# EAGLE schematic PowerRhythm32 (EAGLE 6.1)
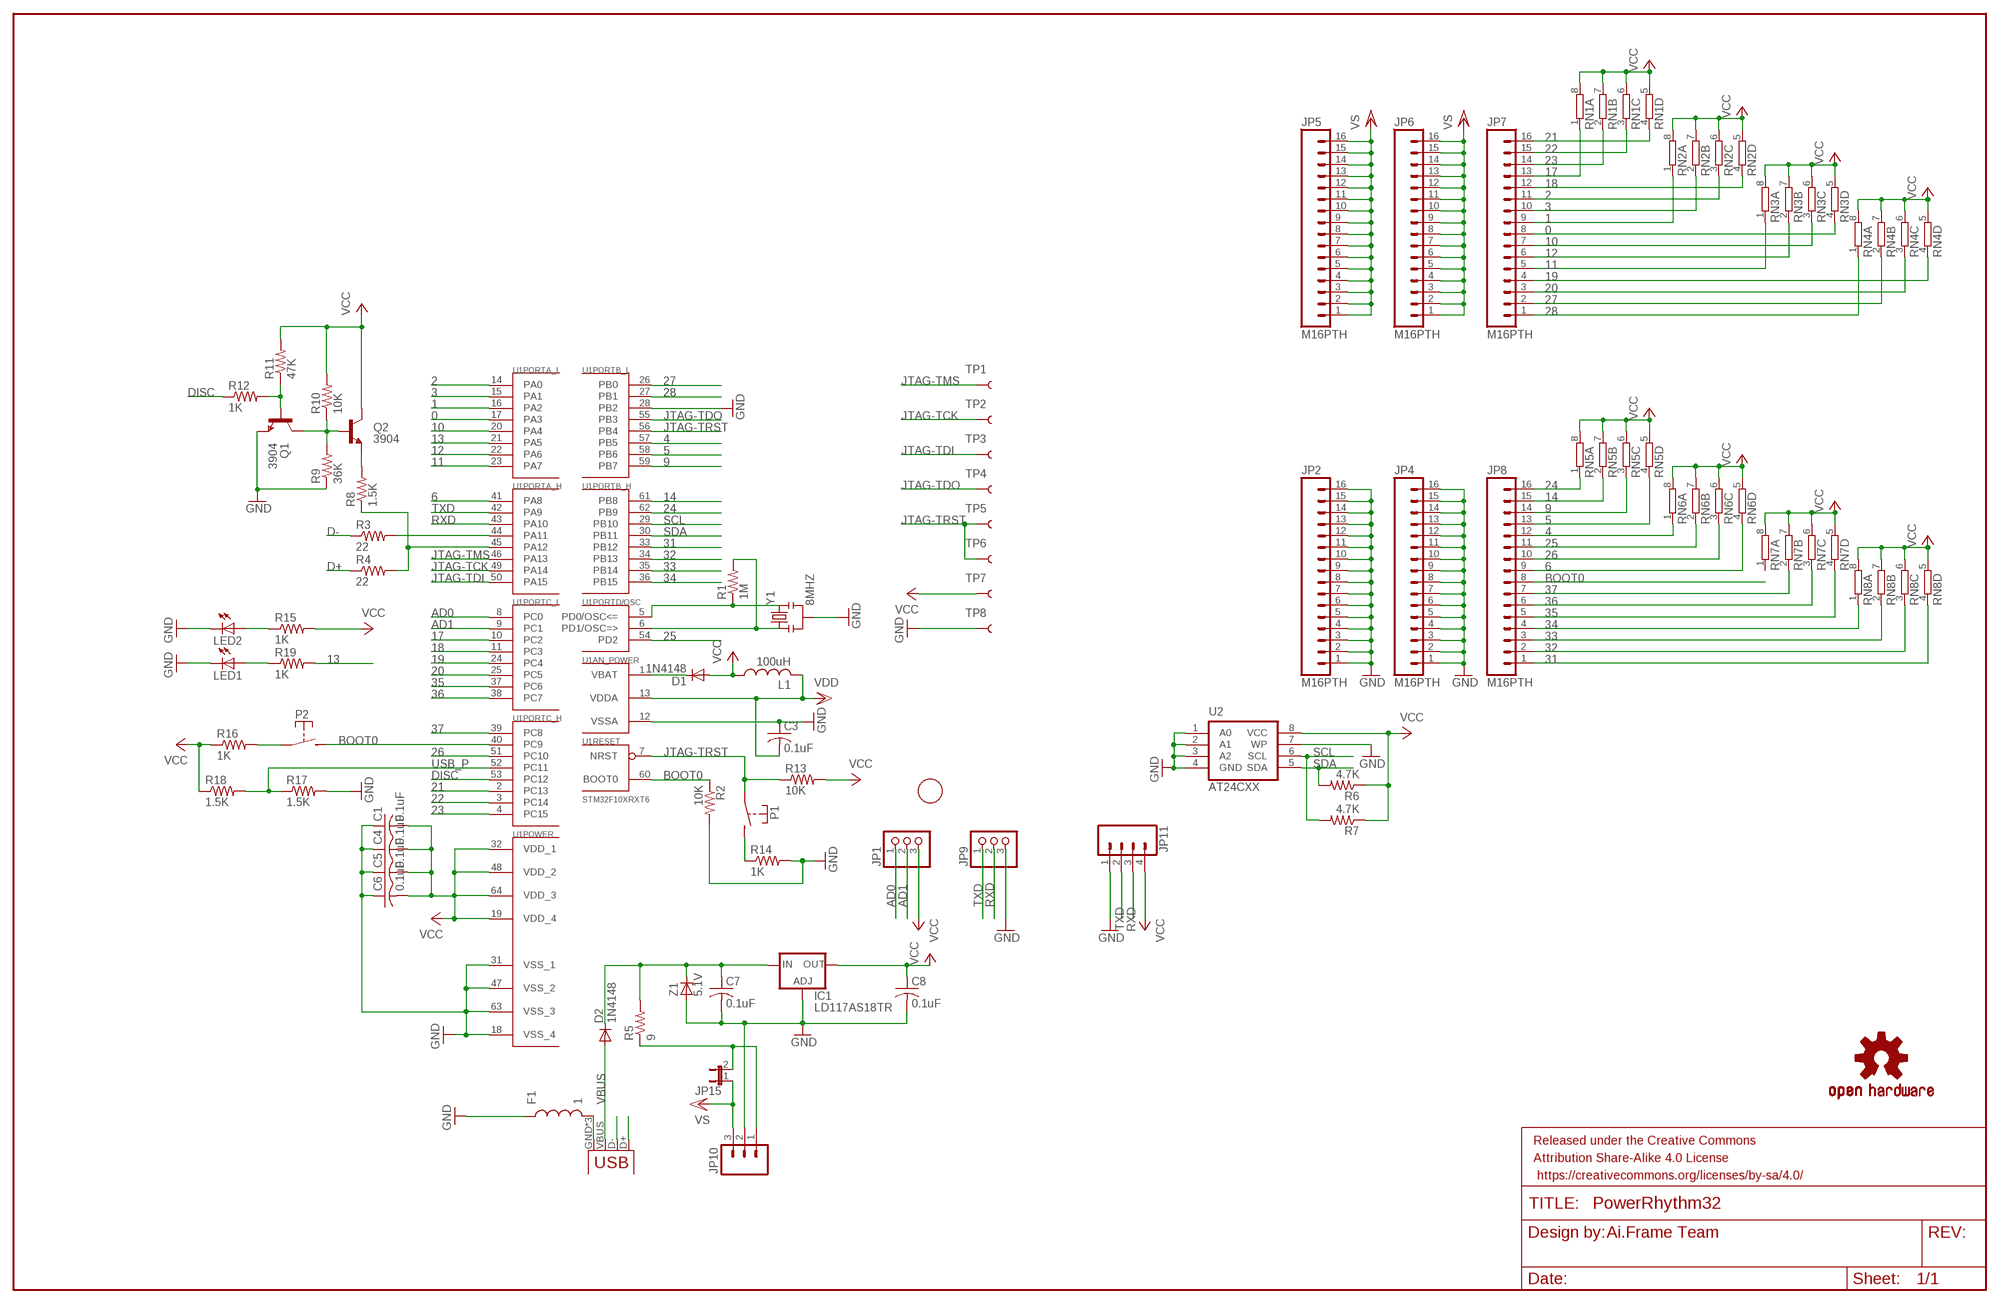
[diagram p0: schematic, sheet 1]

## Parts
C1  0.1uF  C-USC0603K  [C0603K]
C3  0.1uF  C-USC0603K  [C0603K]
C4  0.1uF  C-USC0603K  [C0603K]
C5  0.1uF  C-USC0603K  [C0603K]
C6  0.1uF  C-USC0603K  [C0603K]
C7  0.1uF  C-USC0603K  [C0603K]
C8  0.1uF  C-USC0603K  [C0603K]
D1  1N4148  DIODE-SOD123  [SOD123]
D2  1N4148  DIODE-SOD123  [SOD123]
F1  1  INDUCTOR30OHM,1.8A  [0603]
FRAME1  FRAME-LEDGER  [CREATIVE_COMMONS]
IC1  LD117AS18TR  [SOT223]
JP1  PINHD-1X3  [1X03]
JP2  M16PTH  [1X16]
JP3  USB-MICROB  [USB-MICROB]
JP4  M16PTH  [1X16]
JP5  M16PTH  [1X16]
JP6  M16PTH  [1X16]
JP7  M16PTH  [1X16]
JP8  M16PTH  [1X16]
JP9  PINHD-1X3  [1X03]
JP10  M03SCREW_LOCK  [SCREWTERMINAL-3.5MM-3_LOCK.007S]
JP11  M04PTH  [1X04]
JP15  JUMPER-2PTH  [1X02]
L1  100uH  L-USL2012C  [L2012C]
LED1  LEDCHIP-LED0603  [CHIP-LED0603]
LED2  LEDCHIP-LED0603  [CHIP-LED0603]
LOGO1  OSHW-LOGOS  [OSHW-LOGO-S]
P1  TMAV433BAA  [TMAV433BAA]
P2  TMAV433BAA  [TMAV433BAA]
Q1  3904  TRANSISTOR_NPNMMBT2222A  [SOT23-3]
Q2  3904  TRANSISTOR_NPNMMBT2222A  [SOT23-3]
R1  1M  R-US_R0603  [R0603]
R2  10K  R-US_R0603  [R0603]
R3  22  R-US_R0603  [R0603]
R4  22  R-US_R0603  [R0603]
R5  9  R-US_R1206  [R1206]
R6  4.7K  R-US_R0603  [R0603]
R7  4.7K  R-US_R0603  [R0603]
R8  1.5K  R-US_R0603  [R0603]
R9  36K  R-US_R0603  [R0603]
R10  10K  R-US_R0603  [R0603]
R11  47K  R-US_R0603  [R0603]
R12  1K  R-US_R0603  [R0603]
R13  10K  R-US_R0603  [R0603]
R14  1K  R-US_R0603  [R0603]
R15  1K  R-US_R0603  [R0603]
R16  1K  R-US_R0603  [R0603]
R17  1.5K  R-US_R0603  [R0603]
R18  1.5K  R-US_R0603  [R0603]
R19  1K  R-US_R0603  [R0603]
RN1  4R-N0603-ARC  [0603-ARC]
RN2  4R-N0603-ARC  [0603-ARC]
RN3  4R-N0603-ARC  [0603-ARC]
RN4  4R-N0603-ARC  [0603-ARC]
RN5  4R-N0603-ARC  [0603-ARC]
RN6  4R-N0603-ARC  [0603-ARC]
RN7  4R-N0603-ARC  [0603-ARC]
RN8  4R-N0603-ARC  [0603-ARC]
TP1  TEST-POINT3X5  [PAD.03X.05]
TP2  TEST-POINT3X5  [PAD.03X.05]
TP3  TEST-POINT3X5  [PAD.03X.05]
TP4  TEST-POINT3X5  [PAD.03X.05]
TP5  TEST-POINT3X5  [PAD.03X.05]
TP6  TEST-POINT3X5  [PAD.03X.05]
TP7  TEST-POINT3X5  [PAD.03X.05]
TP8  TEST-POINT3X5  [PAD.03X.05]
U1  STM32F10XRXT6  [TQFP64]
U2  AT24CXX  [SO08-8S1]
U$1  FIDUCIAL  [FIDUCIAL_1MM]
Y1  8MHZ  RESONATOR8MHZ  [RESONATOR-SMD]
Z1  5.1V  ZENER-DIODESOD80C  [SOD80C]

## Nets
0: JP7.8 RN3.4 U1.17(PORTA_L:PA3)
1: JP7.9 RN2.1 U1.16(PORTA_L:PA2)
2: JP7.11 RN2.3 U1.14(PORTA_L:PA0)
3: JP7.10 RN2.2 U1.15(PORTA_L:PA1)
4: JP8.12 RN6.1 U1.57(PORTB_L:PB5)
5: JP8.13 RN5.4 U1.58(PORTB_L:PB6)
6: JP8.9 RN6.4 U1.41(PORTA_H:PA8)
9: JP8.14 RN5.3 U1.59(PORTB_L:PB7)
10: JP7.7 RN3.3 U1.20(PORTA_L:PA4)
11: JP7.5 RN3.1 U1.23(PORTA_L:PA7)
12: JP7.6 RN3.2 U1.22(PORTA_L:PA6)
13: R19.2 U1.21(PORTA_L:PA5)
14: JP8.15 RN5.2 U1.61(PORTB_H:PB8)
17: JP7.13 RN1.1 U1.10(PORTC_L:PC2)
18: JP7.12 RN2.4 U1.11(PORTC_L:PC3)
19: JP7.4 RN4.4 U1.24(PORTC_L:PC4)
20: JP7.3 RN4.3 U1.25(PORTC_L:PC5)
21: JP7.16 RN1.4 U1.2(PORTC_H:PC13)
22: JP7.15 RN1.3 U1.3(PORTC_H:PC14)
23: JP7.14 RN1.2 U1.4(PORTC_H:PC15)
24: JP8.16 RN5.1 U1.62(PORTB_H:PB9)
25: JP8.11 RN6.2 U1.54(PORTD/OSC:PD2)
26: JP8.10 RN6.3 U1.51(PORTC_H:PC10)
27: JP7.2 RN4.2 U1.26(PORTB_L:PB0)
28: JP7.1 RN4.1 U1.27(PORTB_L:PB1)
31: JP8.1 RN8.4 U1.33(PORTB_H:PB12)
32: JP8.2 RN8.3 U1.34(PORTB_H:PB13)
33: JP8.3 RN8.2 U1.35(PORTB_H:PB14)
34: JP8.4 RN8.1 U1.36(PORTB_H:PB15)
35: JP8.5 RN7.4 U1.37(PORTC_L:PC6)
36: JP8.6 RN7.3 U1.38(PORTC_L:PC7)
37: JP8.7 RN7.2 U1.39(PORTC_H:PC8)
AD0: JP1.1 U1.8(PORTC_L:PC0)
AD1: JP1.2 U1.9(PORTC_L:PC1)
BOOT0: JP8.8 P2.P$2(S) R2.1 U1.40(PORTC_H:PC9) U1.60(RESET:BOOT0)
D+: JP3.D+ R4.1
D-: JP3.D- R3.1
DISC: R12.1 U1.53(PORTC_H:PC12)
GND: C1.1 C3.1 C4.1 C5.1 C6.1 C7.2 C8.2 F1.1 IC1.1(ADJ) JP2.1 JP2.2 JP2.3 JP2.4 JP2.5 JP2.6 JP2.7 JP2.8 JP2.9 JP2.10 JP2.11 JP2.12 JP2.13 JP2.14 JP2.15 JP2.16 JP4.1 JP4.2 JP4.3 JP4.4 JP4.5 JP4.6 JP4.7 JP4.8 JP4.9 JP4.10 JP4.11 JP4.12 JP4.13 JP4.14 JP4.15 JP4.16 JP9.3 JP10.2 JP11.1 LED1.C LED2.C Q1.2(E) R2.2 R9.1 R14.2 R17.2 TP8.P$1 U1.12(AN_POWER:VSSA) U1.18(POWER:VSS_4) U1.28(PORTB_L:PB2) U1.31(POWER:VSS_1) U1.47(POWER:VSS_2) U1.63(POWER:VSS_3) U2.1(A0) U2.2(A1) U2.3(A2) U2.4(GND) U2.7(WP) Y1.2 Z1.A
JTAG-TCK: TP2.P$1 U1.49(PORTA_H:PA14)
JTAG-TDI: TP3.P$1 U1.50(PORTA_H:PA15)
JTAG-TDO: TP4.P$1 U1.55(PORTB_L:PB3)
JTAG-TMS: TP1.P$1 U1.46(PORTA_H:PA13)
JTAG-TRST: P1.P$1(P) R13.1 TP5.P$1 TP6.P$1 U1.7(RESET:NRST) U1.56(PORTB_L:PB4)
N$1: R1.2 U1.6(PORTD/OSC:PD1/OSC=>) Y1.1
N$2: D1.C U1.1(AN_POWER:VBAT)
N$3: LED2.A R15.1
N$4: R4.2 R8.1 U1.45(PORTA_H:PA12)
N$5: JP10.1 JP15.2 R5.1
N$6: R1.1 U1.5(PORTD/OSC:PD0/OSC<=) Y1.3
N$8: R3.2 U1.44(PORTA_H:PA11)
N$9: C7.1 D2.C IC1.3(IN) R5.2 Z1.C
N$11: LED1.A R19.1
N$12: F1.2 JP3.GND JP3.MT1(GND) JP3.MT2(GND)
N$14: Q1.3(C) Q2.1(B) R9.2 R10.1
N$15: P1.P$2(S) R14.1
N$16: Q2.2(E) R8.2
N$17: Q1.1(B) R11.1 R12.2
N$19: P2.P$1(P) R16.2
RXD: JP9.2 JP11.3 U1.43(PORTA_H:PA10)
SCL: R7.2 U1.29(PORTB_H:PB10) U2.6(SCL)
SDA: R6.2 U1.30(PORTB_H:PB11) U2.5(SDA)
TXD: JP9.1 JP11.2 U1.42(PORTA_H:PA9)
USB_P: R17.1 R18.2 U1.52(PORTC_H:PC11)
VBUS: D2.A JP3.VBUS
VCC: C1.2 C4.2 C5.2 C6.2 C8.1 D1.A IC1.4(OUT) JP1.3 JP11.4 L1.1 Q2.3(C) R6.1 R7.1 R10.2 R11.2 R13.2 R15.2 R16.1 R18.1 RN1.5 RN1.6 RN1.7 RN1.8 RN2.5 RN2.6 RN2.7 RN2.8 RN3.5 RN3.6 RN3.7 RN3.8 RN4.5 RN4.6 RN4.7 RN4.8 RN5.5 RN5.6 RN5.7 RN5.8 RN6.5 RN6.6 RN6.7 RN6.8 RN7.5 RN7.6 RN7.7 RN7.8 RN8.5 RN8.6 RN8.7 RN8.8 TP7.P$1 U1.19(POWER:VDD_4) U1.32(POWER:VDD_1) U1.48(POWER:VDD_2) U1.64(POWER:VDD_3) U2.8(VCC)
VCC/2: JP5.1 JP5.2 JP5.3 JP5.4 JP5.5 JP5.6 JP5.7 JP5.8 JP5.9 JP5.10 JP5.11 JP5.12 JP5.13 JP5.14 JP5.15 JP5.16 JP6.1 JP6.2 JP6.3 JP6.4 JP6.5 JP6.6 JP6.7 JP6.8 JP6.9 JP6.10 JP6.11 JP6.12 JP6.13 JP6.14 JP6.15 JP6.16 JP10.3 JP15.1 ; supply symbol labelled VS
VDD: C3.2 L1.2 U1.13(AN_POWER:VDDA)
Unconnected: RN7.1

## Notes on the sheet
- Ai.Frame Team

## Library data of the parts
C1 C3-C8 = resistor:C-US: CAPACITOR, American symbol
D1 D2 = diode:DIODE-: DIODE
F1 = SparkFun-Passives:INDUCTOR: Inductors Basic Inductor/Choke - 0603 and 1206. Footprints are not proven and vary greatly between part numbers. SRN6045- 33uH, 20% 1.4A SDR0403-560KL - 56uH, 10%, 500mA RMS/740mA peak; PROD_ID: RES-07859
FRAME1 = SparkFun-Aesthetics:FRAME-LEDGER: Schematic Frame Standard 11x14 US Ledger frame
IC1 = v-reg:LD117A?*: Low drop fixed and adjustable positive voltage regulators 1 A Source: http://www.st.com/stonline/products/literature/ds/7194/ld1117axx.pdf
JP1 JP9 = adafruit:PINHD-1X3: PIN HEADER
JP2 JP4-JP8 = SparkFun-Connectors:M16: 1x16 .1" header
JP3 = SparkFun-Connectors:USB: USB Connectors USB-B-PTH is fully proven SKU : PRT-00139/CONN-08278 USB-miniB is fully proven SKU : PRT-00587 USB-A-PCB is untested. USB-A-H is throughly reviewed, but untested. Spark Fun Electronics SKU : PRT-00437 USB-B-SMT is throughly reviewed, but untested. Needs silkscreen touching up. USB-A-S has not been used/tested USB-MB-H has not been used/tested USB-MICROB has been used. CONN-09505; PROD_ID: CONN-09505
JP10 = SparkFun-Connectors:M03: Header 3 Standard 3-pin 0.1" header. Use with straight break away headers (SKU : PRT-00116), right angle break away headers (PRT-00553), swiss pins (PRT-00743), machine pins (PRT-00117), and female headers (PRT-00115). Molex polarized connector foot print use with SKU : PRT-08232 with associated crimp pins and housings.
JP11 = SparkFun-Connectors:M04: Header 4 Standard 4-pin 0.1" header. Use with straight break away headers (SKU : PRT-00116), right angle break away headers (PRT-00553), swiss pins (PRT-00743), machine pins (PRT-00117), and female headers (PRT-00115). Molex polarized connector foot print use with SKU : PRT-08231 with associated crimp pins and housings. 1MM SMD Version SKU: PRT-10208
JP15 = SparkFun-Passives:JUMPER-2: Jumper Basic 0.1" spaced jumper. Use with breakaway headers.
L1 = resistor:L-US: INDUCTOR, American symbol
LED1 LED2 = adafruit:LED: LED OSRAM: - CHIPLED LG R971, LG N971, LY N971, LG Q971, LY Q971, LO R971, LY R971 LH N974, LH R974 LS Q976, LO Q976, LY Q976 LO Q996 - Hyper CHIPLED LW Q18S LB Q993, LB Q99A, LB R99A - SideLED LS A670, LO A670, LY A670, LG A670, LP A670 LB A673, LV A673, LT A673, LW A673 LH A674 LY A675 LS A676, LA A676, LO A676, LY A676, LW A676 LS A679, LY A679, LG A679 - Hyper Micro SIDELED® LS Y876, LA Y876, LO Y876, LY Y876 LT Y87S - SmartLED LW L88C, LW L88S LB L89C, LB L89S, LG L890 LS L89K, LO L89K, LY L89K LS L896, LA L896, LO L896, LY L896 - TOPLED LS T670, LO T670, LY T670, LG T670, LP T670 LSG T670, LSP T670, LSY T670, LOP T670, LYG T670 LG T671, LOG T671, LSG T671 LB T673, LV T673, LT T673, LW T673 LH T674 LS T676, LA T676, LO T676, LY T676, LB T676, LH T676, LSB T676, LW T676 LB T67C, LV T67C, LT T67C, LS T67K, LO T67K, LY T67K, LW E67C LS E67B, LA E67B, LO E67B, LY E67B, LB E67C, LV E67C, LT E67C LW T67C LS T679, LY T679, LG T679 LS T770, LO T770, LY T770, LG T770, LP T770 LB T773, LV T773, LT T773, LW T773 LH T774 LS E675, LA E675, LY E675, LS T675 LS T776, LA T776, LO T776, LY T776, LB T776 LHGB T686 LT T68C, LB T68C - Hyper Mini TOPLED® LB M676 - Mini TOPLED Santana® LG M470 LS M47K, LO M47K, LY M47K Source: http://www.osram.convergy.de/
LOGO1 = SparkFun-Aesthetics:OSHW-LOGO: Open Source Hardware Logo This logo indicates the piece of hardware it is found on incorporates a OSHW license and/or adheres to the definition of open source hardware found here: http://freedomdefined.org/OSHW
P1 P2 = switch-misc:TMAV433BAA
Q1 Q2 = SparkFun-DiscreteSemi:TRANSISTOR_NPN: Generic NPN BJT MMBT2222A - TRANS-08049 (SOT-23, 1A 40V) MPSA42 - TRANS-09116 (SOT-23, 500mA 300V) MMBT5088LT1G - TRANS-11160 (SOT-23, 50 mA 30V); PROD_ID: TRANS-08049; VALUE: MMBT2222A
R1-R19 = resistor:R-US_: RESISTOR, American symbol
RN1-RN8 = resistor-dil:4R-N: Array Chip Resistor Source: RS Component / Phycomp; OC_FARNELL: unknown; OC_NEWARK: unknown
TP1-TP8 = SparkFun-Passives:TEST-POINT: Bare copper test points for troubleshooting or ICT
U1 = stm32:STM32F10XRXT6: STM32F101/103 64pin LQFP
U2 = memory-atmel:AT24CXX: EEPROM SPI bus serial
U$1 = adafruit:FIDUCIAL: For use by pick and place machines to calibrate the vision/machine, 1mm By microbuilder.eu
Y1 = SparkFun-FreqCtrl:RESONATOR: Resonator Small SMD resonator. Used, eg, on the Arduino Pro/ Pro Mini boards. 8MHz- XTAL-08895 16MHz- XTAL-08900; PROD_ID: XTAL-08895
Z1 = diode:ZENER-DIODE: Z-Diode